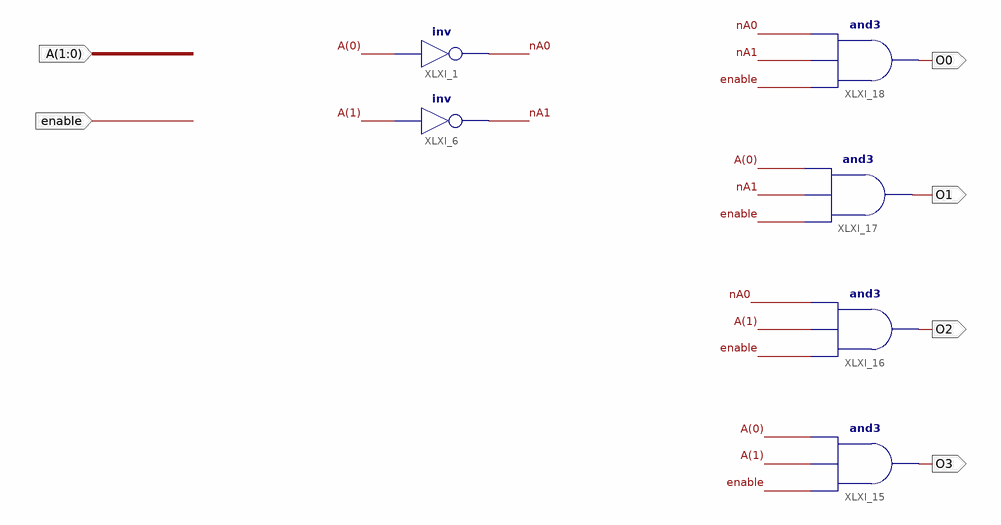
[diagram p0: schematic sheet 1]
// Xilinx ISE schematic decode2b4.sch (spartan3e) as structural Verilog: 6 symbols, 6 ports
module decode2b4 (
  input  [1:0] A,
  input  enable,
  output O0,
  output O1,
  output O2,
  output O3
);

  wire nA0, nA1;

  not XLXI_1 (nA0, A[0]);
  not XLXI_6 (nA1, A[1]);
  and XLXI_15 (O3, enable, A[1], A[0]);
  and XLXI_16 (O2, enable, A[1], nA0);
  and XLXI_17 (O1, enable, nA1, A[0]);
  and XLXI_18 (O0, enable, nA1, nA0);
endmodule
